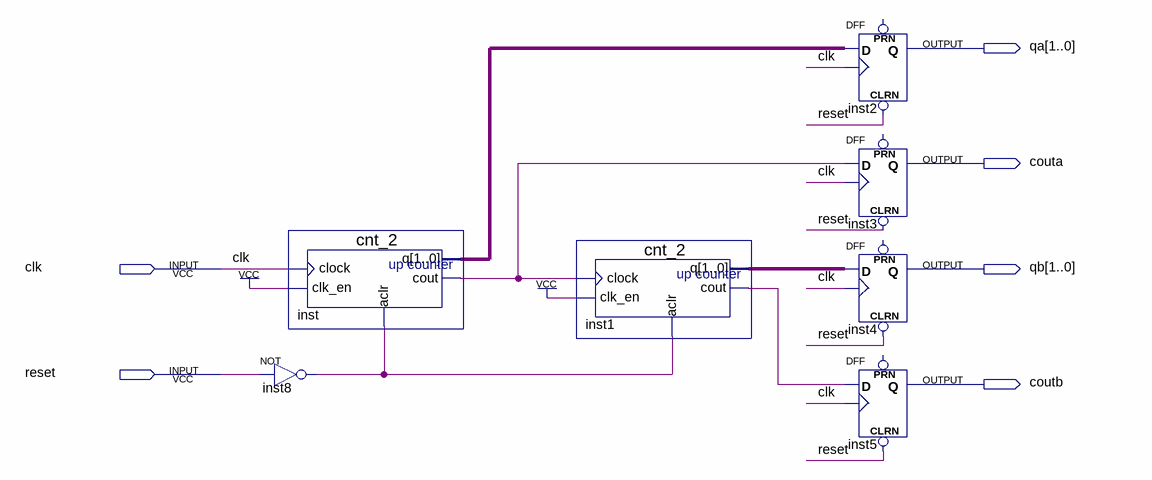
[diagram p0: schematic sheet]
// Quartus schematic lab4.bdf as structural Verilog: 7 symbols, 6 pins
module lab4 (
  input  clk,
  input  reset,
  output [1:0] qa,
  output couta,
  output [1:0] qb,
  output coutb
);

  wire inst1_cout, inst8_out, inst_cout;
  wire [1:0] inst1_q, inst_q;

  cnt_2 inst (.clock(clk), .clk_en(1'b1), .aclr(inst8_out), .cout(inst_cout), .q(inst_q));
  not inst8 (inst8_out, reset);
  cnt_2 inst1 (.clock(inst_cout), .clk_en(1'b1), .aclr(inst8_out), .cout(inst1_cout), .q(inst1_q));
  DFF inst2[1:0] (.CLRN(reset), .CLK(clk), .D(inst_q), .Q(qa));  // open: PRN
  DFF inst3 (.CLRN(reset), .CLK(clk), .D(inst_cout), .Q(couta));  // open: PRN
  DFF inst4[1:0] (.CLRN(reset), .CLK(clk), .D(inst1_q), .Q(qb));  // open: PRN
  DFF inst5 (.CLRN(reset), .CLK(clk), .D(inst1_cout), .Q(coutb));  // open: PRN
endmodule
